# EAGLE schematic cv-utils (EAGLE 9.6.2)
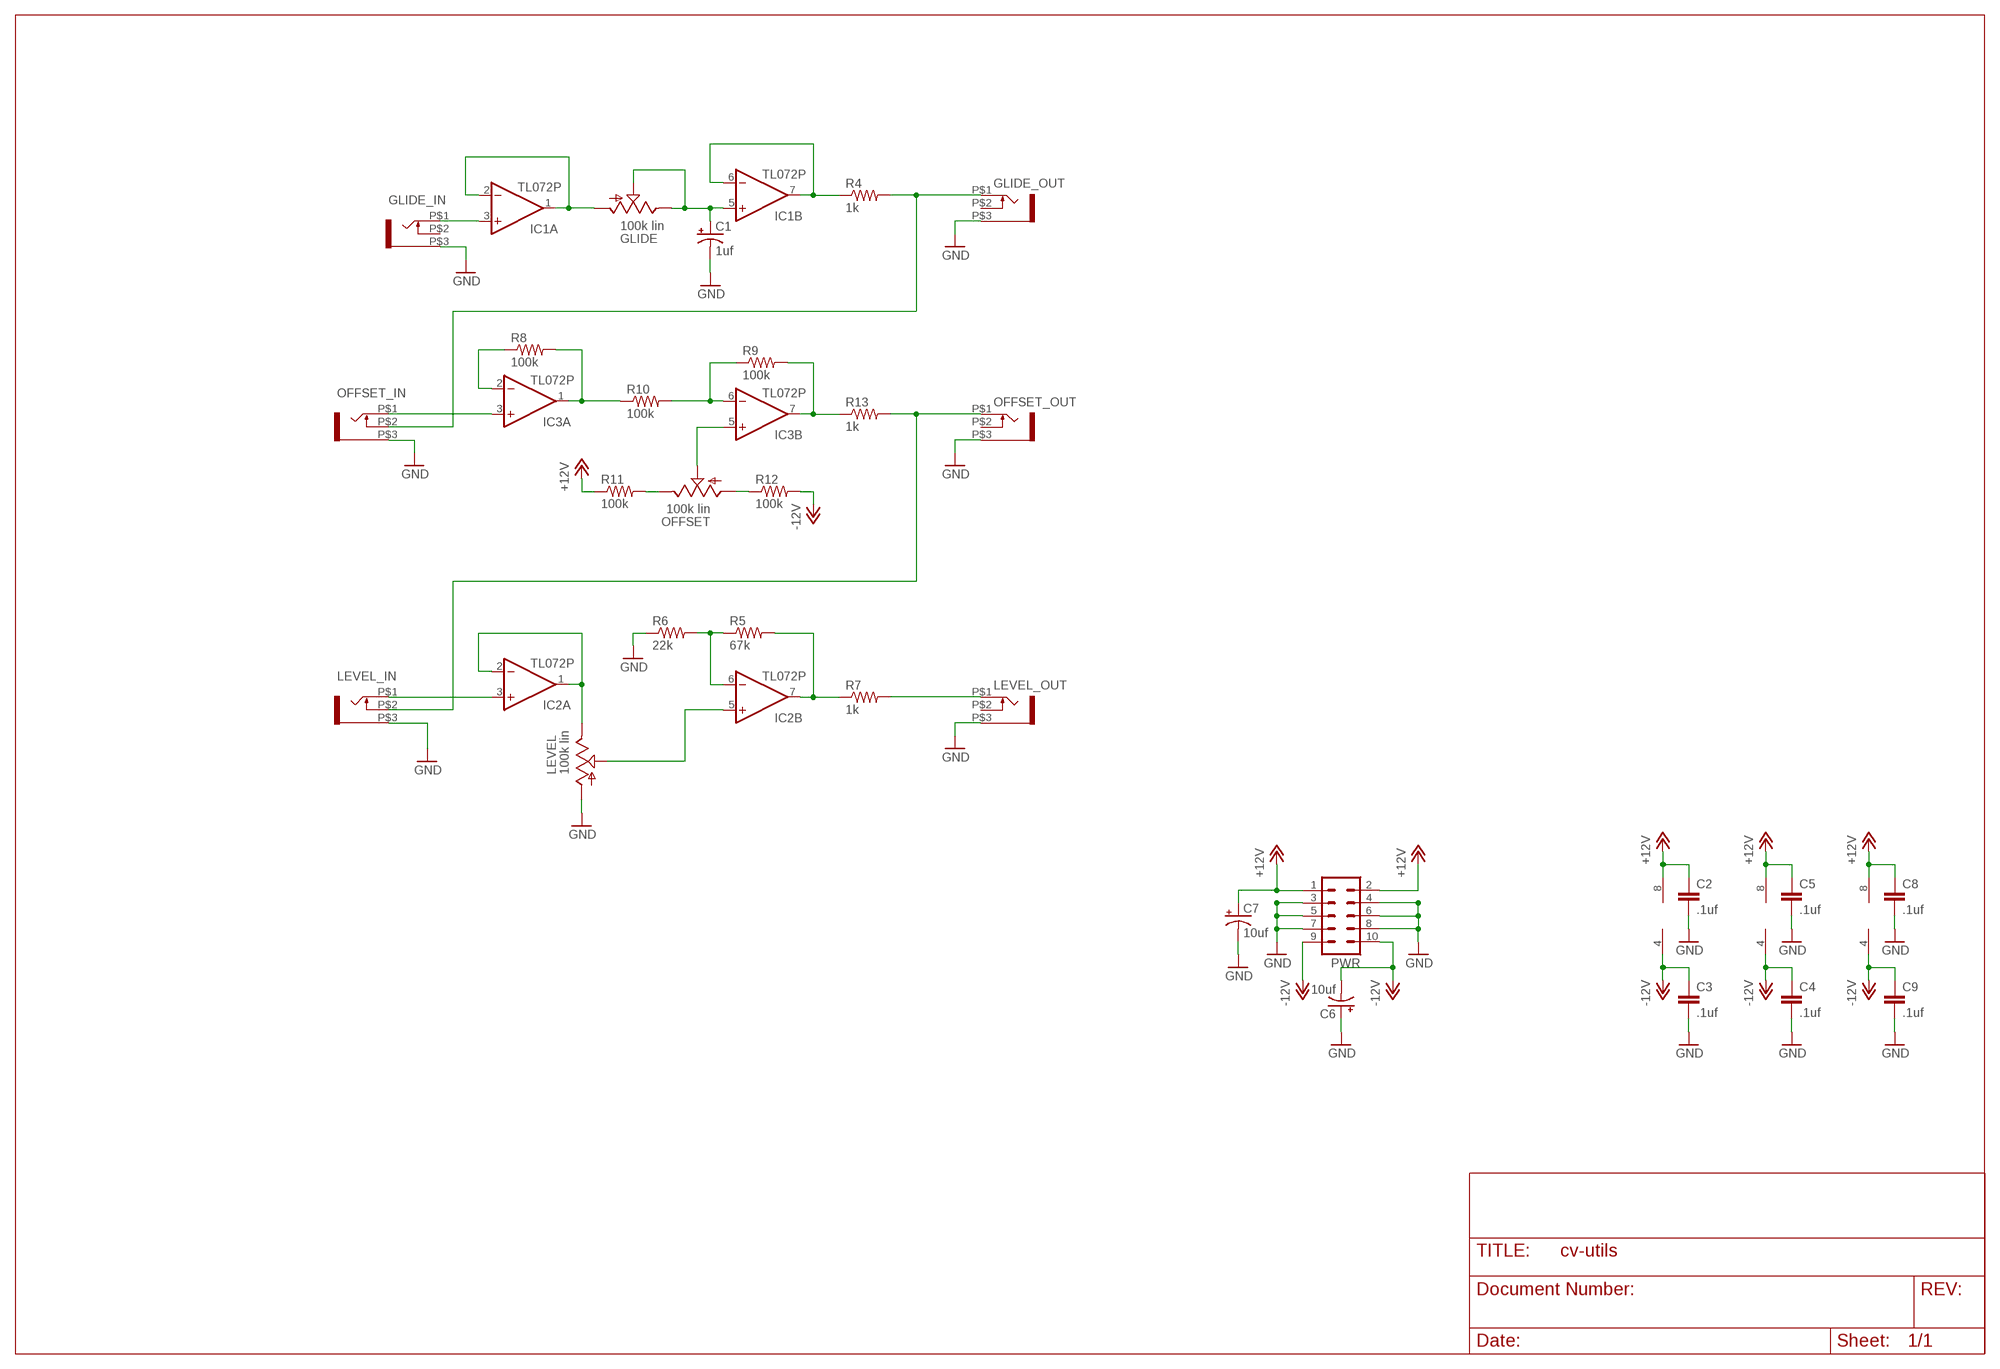
[diagram p0: schematic, sheet 1]

## Parts
C1  1uf  CPOL-USE2.5-6  [E2,5-6]
C2  .1uf  C-EU050-024X044  [C050-024X044]
C3  .1uf  C-EU050-024X044  [C050-024X044]
C4  .1uf  C-EU050-024X044  [C050-024X044]
C5  .1uf  C-EU050-024X044  [C050-024X044]
C6  10uf  CPOL-USE2.5-5  [E2,5-5]
C7  10uf  CPOL-USE2.5-5  [E2,5-5]
C8  .1uf  C-EU050-024X044  [C050-024X044]
C9  .1uf  C-EU050-024X044  [C050-024X044]
GLIDE  100k lin  ALPHA-9MMA  [EVUF]
GLIDE_IN  WQP-PJ301M-12_JACK  [WQP-PJ301M-12_JACK]
GLIDE_OUT  WQP-PJ301M-12_JACK  [WQP-PJ301M-12_JACK]
IC1  TL072P  [DIL08]
IC2  TL072P  [DIL08]
IC3  TL072P  [DIL08]
LEVEL  100k lin  ALPHA-9MMA  [EVUF]
LEVEL_IN  WQP-PJ301M-12_JACK  [WQP-PJ301M-12_JACK]
LEVEL_OUT  WQP-PJ301M-12_JACK  [WQP-PJ301M-12_JACK]
OFFSET  100k lin  ALPHA-9MMA  [EVUF]
OFFSET_IN  WQP-PJ301M-12_JACK  [WQP-PJ301M-12_JACK]
OFFSET_OUT  WQP-PJ301M-12_JACK  [WQP-PJ301M-12_JACK]
PWR  ML10  [ML10]
R4  1k  R-US_0204/7  [0204/7]
R5  67k  R-US_0204/7  [0204/7]
R6  22k  R-US_0204/7  [0204/7]
R7  1k  R-US_0204/7  [0204/7]
R8  100k  R-US_0204/7  [0204/7]
R9  100k  R-US_0204/7  [0204/7]
R10  100k  R-US_0204/7  [0204/7]
R11  100k  R-US_0204/7  [0204/7]
R12  100k  R-US_0204/7  [0204/7]
R13  1k  R-US_0204/7  [0204/7]

## Nets
+12V: C2.1 C5.1 C7.+ C8.1 IC1.8(P:V+) IC2.8(P:V+) IC3.8(P:V+) PWR.1 PWR.2 R11.1
-12V: C3.1 C4.1 C6.- C9.1 IC1.4(P:V-) IC2.4(P:V-) IC3.4(P:V-) PWR.9 PWR.10 R12.2
GND: C1.- C2.2 C3.2 C4.2 C5.2 C6.+ C7.- C8.2 C9.2 GLIDE_IN.P$3 GLIDE_OUT.P$3 LEVEL.1(A) LEVEL_IN.P$3 LEVEL_OUT.P$3 OFFSET_IN.P$3 OFFSET_OUT.P$3 PWR.3 PWR.4 PWR.5 PWR.6 PWR.7 PWR.8 R6.1
IO_LEVEL_W: IC2.5(B:+IN) LEVEL.2(S)
IO_OFFSET_IN: IC3.3(A:+IN) OFFSET_IN.P$1
IO_OFFSET_OUT: LEVEL_IN.P$2 OFFSET_OUT.P$1 R13.2
IO_SLIDE_A: GLIDE.1(A) IC1.1(A:OUT) IC1.2(A:-IN)
IO_SLIDE_B: C1.+ GLIDE.2(S) GLIDE.3(E) IC1.5(B:+IN)
IO_SLIDE_IN: GLIDE_IN.P$1 IC1.3(A:+IN)
M_LEVEL_A: IC2.1(A:OUT) IC2.2(A:-IN) LEVEL.3(E)
M_LEVEL_IN: IC2.3(A:+IN) LEVEL_IN.P$1
M_LEVEL_OUT: LEVEL_OUT.P$1 R7.2
M_OFFSET: IC3.5(B:+IN) OFFSET.2(S)
M_SLIDE_OUT: GLIDE_OUT.P$1 OFFSET_IN.P$2 R4.2
N$4: IC1.6(B:-IN) IC1.7(B:OUT) R4.1
N$9: IC2.6(B:-IN) R5.1 R6.2
N$10: IC2.7(B:OUT) R5.2 R7.1
N$11: IC3.6(B:-IN) R9.1 R10.2
N$12: IC3.1(A:OUT) R8.2 R10.1
N$13: IC3.2(A:-IN) R8.1
N$14: IC3.7(B:OUT) R9.2 R13.1
N$17: OFFSET.1(A) R12.1
N$18: OFFSET.3(E) R11.2
Unconnected: GLIDE_IN.P$2 GLIDE_OUT.P$2 LEVEL_OUT.P$2 OFFSET_OUT.P$2

## Library data of the parts
C1 C6 C7 = resistor:CPOL-US: POLARIZED CAPACITOR, American symbol
C2-C5 C8 C9 = resistor:C-EU: CAPACITOR, European symbol
GLIDE LEVEL OFFSET = TomW:ALPHA-9MM: 9 mm Square Rotary Potentiometers Source: Panasonic
GLIDE_IN GLIDE_OUT LEVEL_IN LEVEL_OUT OFFSET_IN OFFSET_OUT = thonkiconn:WQP-PJ301M-12_JACK
IC1-IC3 = TomW:TL072: OP AMP
PWR = con-ml:ML10: HARTING; OC_FARNELL: unknown; OC_NEWARK: unknown
R4-R13 = resistor:R-US_: RESISTOR, American symbol